# Altium schematic sheet Sch.SchDoc
size A4
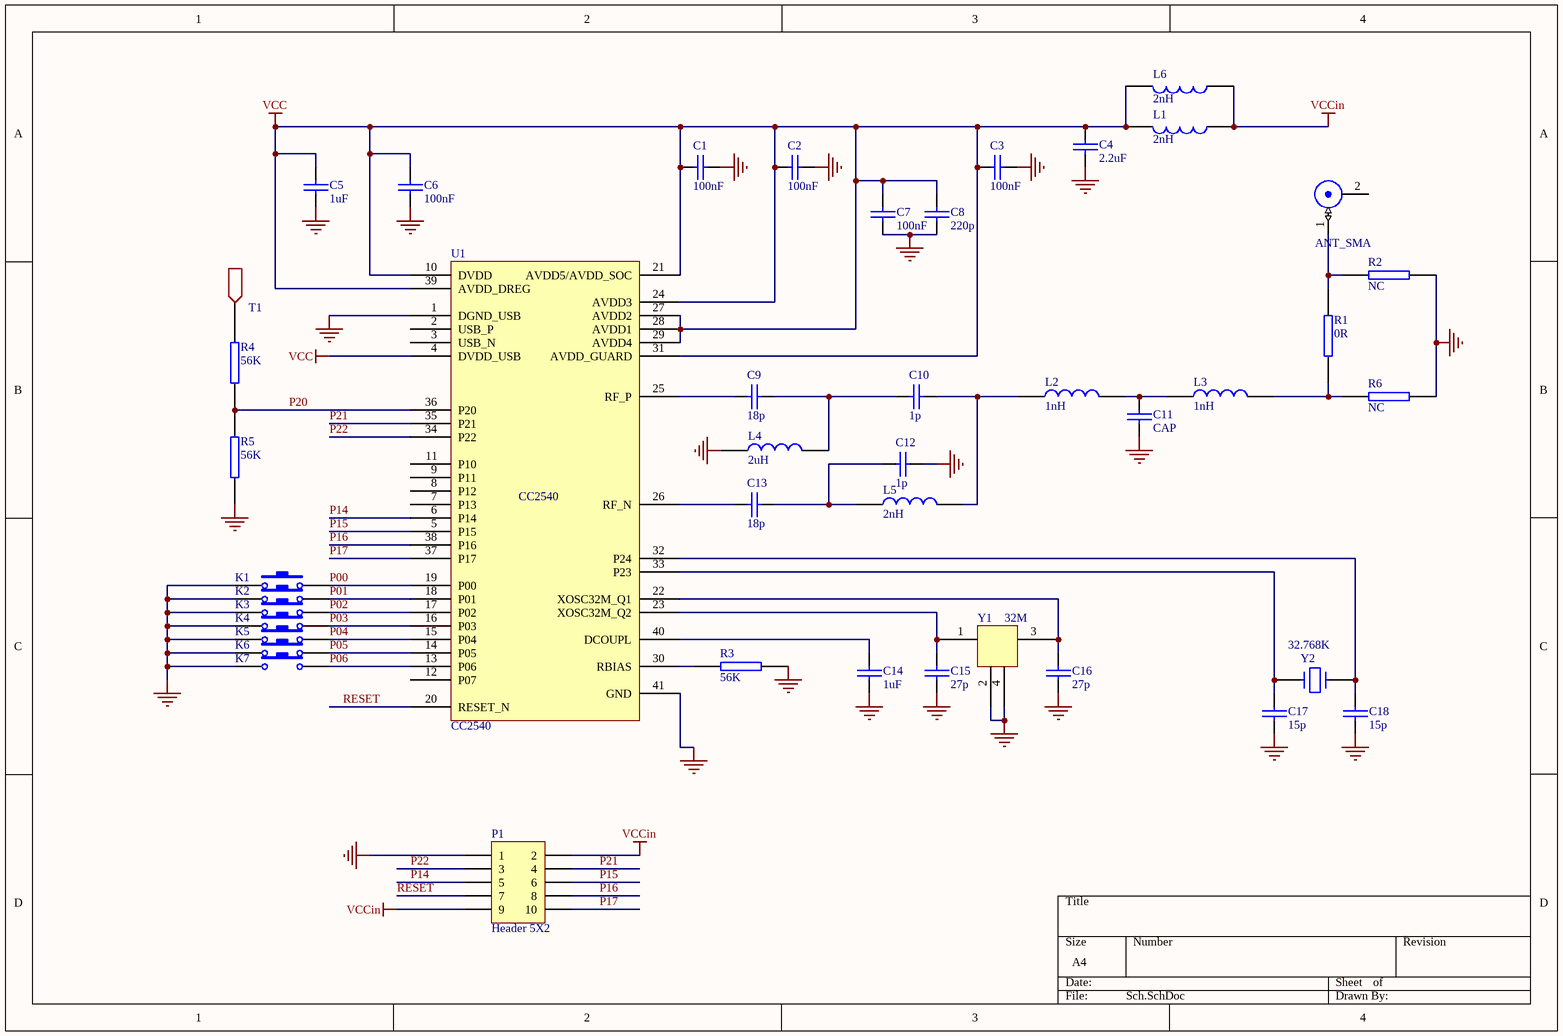
[diagram p0: Sch.SchDoc]

## Parts
?  ANT_SMA  [Wire]
C1  100nF  [0402_SMALL]
C2  100nF  [0402_SMALL]
C3  100nF  [0402_SMALL]
C4  2.2uF  [0402_SMALL]
C5  1uF  [0402_SMALL]
C6  100nF  [0402_SMALL]
C7  100nF  [0402_SMALL]
C8  220p  [0402_SMALL]
C9  18p  [0402_SMALL]
C10  1p  [0402_SMALL]
C11  CAP  [0402_SMALL]
C12  1p  [0402_SMALL]
C13  18p  [0402_SMALL]
C14  1uF  [0402_SMALL]
C15  27p  [0402_SMALL]
C16  27p  [0402_SMALL]
C17  15p  [0402_SMALL]
C18  15p  [0402_SMALL]
K1  (no value)  [MiniKey]
K2  (no value)  [MiniKey]
K3  (no value)  [MiniKey]
K4  (no value)  [MiniKey]
K5  (no value)  [MiniKey]
K6  (no value)  [MiniKey]
K7  (no value)  [MiniKey]
L1  2nH  [0402_SMALL]
L2  1nH  [0402_SMALL]
L3  1nH  [0402_SMALL]
L4  2uH  [0402_SMALL]
L5  2nH  [0402_SMALL]
L6  2nH  [0402_SMALL]
P1  Header 5X2  [HDR2_5]
R1  0R  [0402_SMALL]
R2  NC  [0402_SMALL]
R3  56K  [0402_SMALL]
R4  56K  [0402_SMALL]
R5  56K  [0402_SMALL]
R6  NC  [0402_SMALL]
T1  Pad  [T]  (value not drawn)
U1  CC2540  [CC2530_QFN]
Y1  32M  [CY_3225]
Y2  32.768K  [CRYSTAL_3215]

## Nets
GND: C1.2 C2.2 C3.2 C4.2 C5.2 C6.2 C7.1 C8.1 C11.2 C12.2 C14.2 C15.2 C16.2 C17.2 C18.2 K1.1 K2.1 K3.1 K4.1 K5.1 K6.1 K7.1 L4.1 P1.1 R2.1 R3.2 R5.1 R6.1 U1.1(DGND_USB) U1.41(GND) Y1.2 Y1.4
VCC: C1.1 C2.1 C3.1 C4.1 C5.1 C6.1 C7.2 C8.2 L1.2 L6.2 U1.4(DVDD_USB) U1.10(DVDD) U1.21(AVDD5/AVDD_SOC) U1.24(AVDD3) U1.27(AVDD2) U1.28(AVDD1) U1.29(AVDD4) U1.31(AVDD_GUARD) U1.39(AVDD_DREG)
VCCin: L1.1 L6.1 P1.2 P1.9
P00: K1.2 U1.19(P00)
P01: K2.2 U1.18(P01)
P02: K3.2 U1.17(P02)
P03: K4.2 U1.16(P03)
P04: K5.2 U1.15(P04)
P05: K6.2 U1.14(P05)
P06: K7.2 U1.13(P06)
P14: P1.5 U1.6(P14)
P15: P1.6 U1.5(P15)
P16: P1.8 U1.38(P16)
P17: P1.10 U1.37(P17)
P20: R4.1 R5.2 U1.36(P20)
P21: P1.4 U1.35(P21)
P22: P1.3 U1.34(P22)
RESET: P1.7 U1.20(RESET_N)
Net?_1: ?.1 R1.2 R2.2
NetC9_1: C9.1 U1.25(RF_P)
NetC9_2: C9.2 C10.1 L4.2
NetC10_2: C10.2 L2.1 L5.2
NetC11_1: C11.1 L2.2 L3.1
NetC12_1: C12.1 C13.2 L5.1
NetC13_1: C13.1 U1.26(RF_N)
NetC14_1: C14.1 U1.40(DCOUPL)
NetC15_1: C15.1 U1.23(XOSC32M_Q2) Y1.1
NetC16_1: C16.1 U1.22(XOSC32M_Q1) Y1.3
NetC17_1: C17.1 U1.33(P23) Y2.1
NetC18_1: C18.1 U1.32(P24) Y2.2
NetL3_2: L3.2 R1.1 R6.2
NetR3_1: R3.1 U1.30(RBIAS)
NetR4_2: R4.2 T1.1

Not connected (* = marked no-connect by the designer): ? 2; U1 2(USB_P) 3(USB_N) 7(P13) 8(P12) 9(P11) 11(P10) 12(P07)

## Library data of the parts
C1-C18 = CAP: Capacitor
K1-K7 = SW-PB: Switch; Published: 24-Mar-1999; LatestRevisionDate: 17-Jul-2002; LatestRevisionNote: Re-released for DXP Platform.; PackageReference: SPST-2; Publisher: Altium Limited
L1-L6 = INDUCTOR
P1 = Header 5X2: Header, 5-Pin, Dual row; LatestRevisionDate: 17-Jul-2002; LatestRevisionNote: Re-released for DXP Platform.; Publisher: Altium Limited
R1-R6 = RES2
Y1 = CY_3225
Y2 = CRYSTAL